# EAGLE board DuinoMite_Rev_C (EAGLE 4.16), part 1 of 2
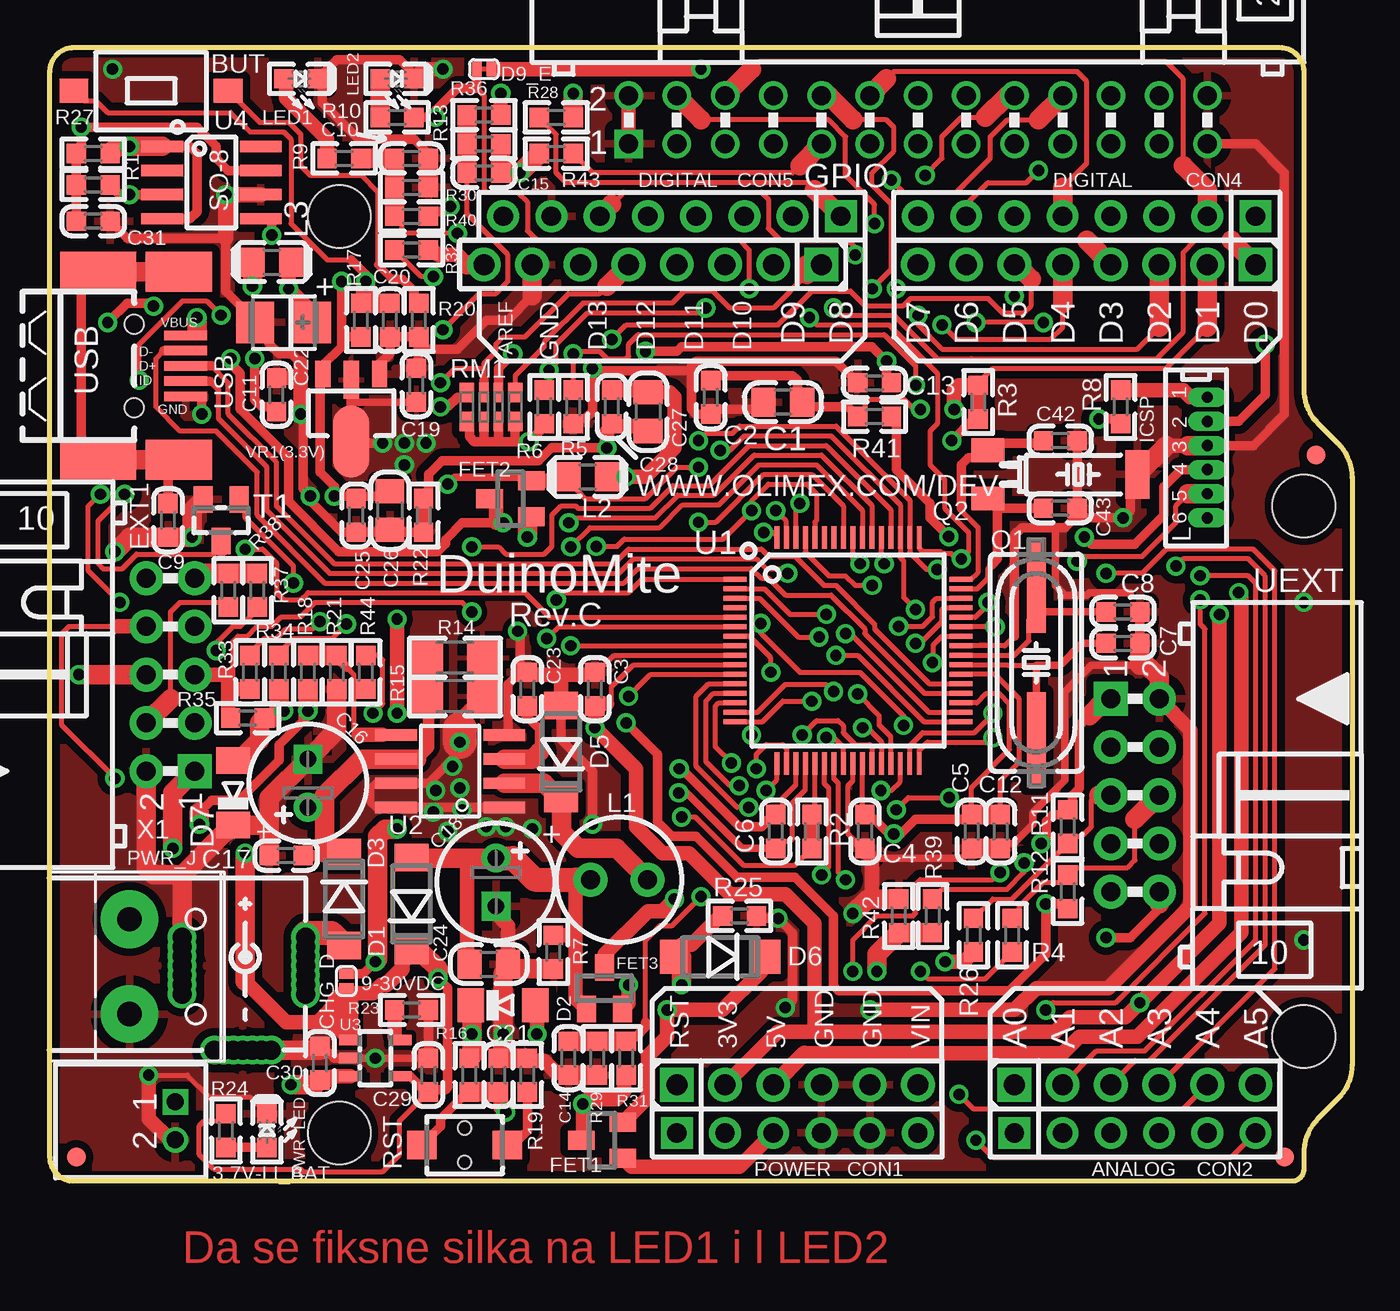
[diagram p1: board, top side]
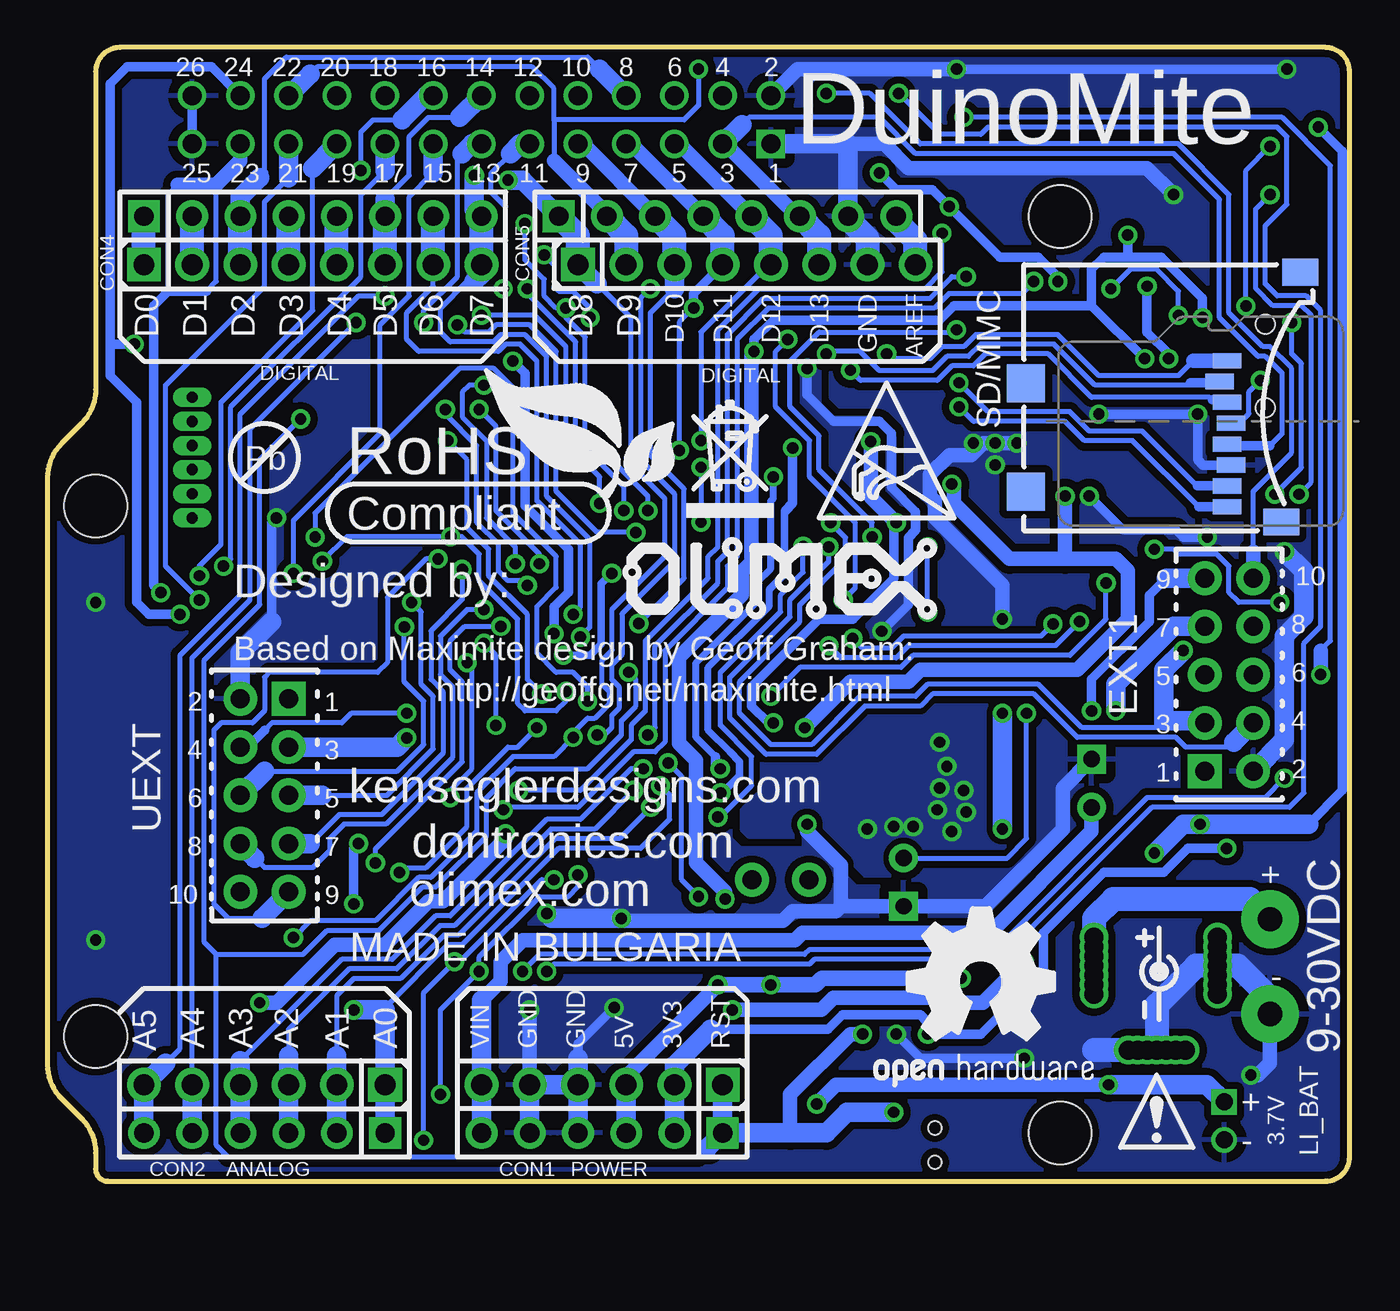
[diagram p2: board, bottom side, seen from below]

Size 68.58 x 59.69 mm. Coordinates in mm from the lower left corner, seen from the top.
Copper layers (1+16): Top 0.035mm / dielectric 1.5mm / Bottom 0.035mm
Design rules "default": minimum track width 10mil, minimum drill 0.6mm, track to track 9.5mil, track to pad 9.5mil, pad to pad 9.5mil, via to via 9.5mil, smd to smd 1mil, copper to edge 10mil, drill to drill 8mil, minimum pad ring 8mil, minimum via ring 8mil, stop-mask expansion 4mil, vias tented up to drill 25mil, thermal gap 20mil
Net classes: 1 pwr: width 0.25 mm

## Footprints (pad centres in the part's own frame; a part is rotated, then mirrored left to right if it is on the bottom)
DW02R = drill 0.9 square: 1 -1,0 | drill 0.9 round: 2 1,0
WS-TAKT_6X3.5_SMD_NOCREAM = smd 1.27 x 1.524: P$1 0,4.064; P$2 0,-4.064
C0805_5MIL_DWS = smd 1.27 x 1.524: 1 -1.016,0; 2 1.016,0
C0603_DWS = smd 1.016 x 1.016: 1 -0.889,0; 2 0.889,0
E2,5-6,3 = drill 0.864 pad 1.524 round: + -1.27,0 | drill 0.864 pad 1.524 square: - 1.27,0
CT3528 = smd 2 x 2.2: + -1.5,0; - 1.5,0
SJ_1_SMALLER = smd 0.508 x 0.762: 1 -0.381,0; 2 0.381,0
PN1X6 = drill 1.1 pad 1.778 square: 1 -6.35,0 | drill 1.1 pad 1.778 round: 2 -3.81,0; 3 -1.27,0; 4 1.27,0; 5 3.81,0; 6 6.35,0
PN1X8 = drill 1.1 pad 1.778 square: 1 -8.89,0 | drill 1.1 pad 1.778 round: 2 -6.35,0; 3 -3.81,0; 4 -1.27,0; 5 1.27,0; 6 3.81,0; 7 6.35,0; 8 8.89,0
MLL-41 = smd 1.45 x 1.8: A 2.445,0; K -2.445,0
MINI-MELF = smd 1.4 x 1.8: A 1.7,0; C -1.7,0
SJ_1_SMALLER_CLOSE = smd 0.508 x 0.762: 1 -0.381,0; 2 0.381,0
BH10R = drill 1 pad 1.778 square: 1 -5.08,-1.27 | drill 1 pad 1.778 round: 2 -5.08,1.27; 3 -2.54,-1.27; 4 -2.54,1.27; 5 0,-1.27; 6 0,1.27; 7 2.54,-1.27; 8 2.54,1.27; 9 5.08,-1.27; 10 5.08,1.27
SOT23 = smd 1 x 1.4: 1 -0.95,-1.1; 2 0.95,-1.1; 3 0,1.1
BH26R = drill 1 square: 1 -15.24,-1.27 | drill 1 round: 2 -15.24,1.27; 3 -12.7,-1.27; 4 -12.7,1.27; 5 -10.16,-1.27; 6 -10.16,1.27; 7 -7.62,-1.27; 8 -7.62,1.27; 9 -5.08,-1.27; 10 -5.08,1.27; 11 -2.54,-1.27; 12 -2.54,1.27; 13 0,-1.27; 14 0,1.27; 15 2.54,-1.27; 16 2.54,1.27; 17 5.08,-1.27; 18 5.08,1.27; 19 7.62,-1.27; 20 7.62,1.27; 21 10.16,-1.27; 22 10.16,1.27; 23 12.7,-1.27; 24 12.7,1.27; 25 15.24,-1.27; 26 15.24,1.27
SW68 = drill 1 pad 1.778 round: 1 -1.5,0; 2 1.5,0
L0805_5MIL_DWS = smd 1.27 x 1.524: 1 -1.016,0; 2 1.016,0
LED-0603 = smd 1.016 x 1.016: A 0.889,0; C -0.889,0
PWR_JACK_UNI_MILLING = drill 1 round: + 0,4.75; +1 0,5.25; +2 0,5.75; +3 0,6.25; +4 0,4.25; +5 0,3.75; +6 0,3.25; - -6.5,4.75; -1 -6.5,5.25; -2 -6.5,5.75; -3 -6.5,4.25; -4 -6.5,3.75; -5 -6.5,6.25; -6 -6.5,3.25; -- -3.3,0.3; --1 -3.8,0.3; --2 -4.3,0.3; --3 -4.8,0.3; --4 -2.8,0.3; --5 -2.3,0.3; --6 -1.8,0.3
HC49/SMD2_THIN = smd 5 x 1: 1 -4.064,0; 2 4.064,0
TC26H_3_REPAIR_SMD = smd 1.27 x 1.778: 1 -1.27,0; 2 1.27,0 | smd 2.54 x 1.27: GND 0,7.874
R0603_5MIL_DWS = smd 1.016 x 1.016: 1 -0.889,0; 2 0.889,0
0603_0R = smd 1.016 x 1.016: 1 -0.889,0; 2 0.889,0
R1206_5MIL_WS = smd 1.651 x 1.778: 1 -1.46,0; 2 1.46,0
R_MATRIX_4 = smd 1.016 x 0.762: 1.1 -0.762,1.27; 1.2 0.762,1.27; 4.1 -0.762,-1.27; 4.2 0.762,-1.27 | smd 1.016 x 0.508: 2.1 -0.762,0.381; 2.2 0.762,0.381; 3.1 -0.762,-0.381; 3.2 0.762,-0.381
IT1185AU2 = smd 1.55 x 1.5: 1 -2.25,0; 2 2.25,0 | hole 0.7: 0,-0.9; 0,0.9
TFR-MEM-CON = smd 0.8 x 1.5: 1 -3.2,10.7; 2 -2.1,10.3; 3 -1,10.7; 4 0.1,10.9; 5 1.2,10.7; 6 2.3,10.9; 7 3.4,10.7; 8 4.5,10.7 | smd 2 x 2: 9 3.7,0.1; 10 -2,0.1 | smd 1.4 x 1.9: 11 5.3,13.55; 12 -7.85,14.55
SOT-23 = smd 1 x 1.4: 1 -0.95,-1.1; 2 0.95,-1.1; 3 0,1.1
LPTQFP64 = smd 1.2 x 0.254: 1 -5.95,3.75; 2 -5.95,3.25; 3 -5.95,2.75; 4 -5.95,2.25; 5 -5.95,1.75; 6 -5.95,1.25; 7 -5.95,0.75; 8 -5.95,0.25; 9 -5.95,-0.25; 10 -5.95,-0.75; 11 -5.95,-1.25; 12 -5.95,-1.75; 13 -5.95,-2.25; 14 -5.95,-2.75; 15 -5.95,-3.25; 16 -5.95,-3.75; 33 5.95,-3.75; 34 5.95,-3.25; 35 5.95,-2.75; 36 5.95,-2.25; 37 5.95,-1.75; 38 5.95,-1.25; 39 5.95,-0.75; 40 5.95,-0.25; 41 5.95,0.25; 42 5.95,0.75; 43 5.95,1.25; 44 5.95,1.75; 45 5.95,2.25; 46 5.95,2.75; 47 5.95,3.25; 48 5.95,3.75 | smd 0.254 x 1.2: 17 -3.75,-5.95; 18 -3.25,-5.95; 19 -2.75,-5.95; 20 -2.25,-5.95; 21 -1.75,-5.95; 22 -1.25,-5.95; 23 -0.75,-5.95; 24 -0.25,-5.95; 25 0.25,-5.95; 26 0.75,-5.95; 27 1.25,-5.95; 28 1.75,-5.95; 29 2.25,-5.95; 30 2.75,-5.95; 31 3.25,-5.95; 32 3.75,-5.95; 49 3.75,5.95; 50 3.25,5.95; 51 2.75,5.95; 52 2.25,5.95; 53 1.75,5.95; 54 1.25,5.95; 55 0.75,5.95; 56 0.25,5.95; 57 -0.25,5.95; 58 -0.75,5.95; 59 -1.25,5.95; 60 -1.75,5.95; 61 -2.25,5.95; 62 -2.75,5.95; 63 -3.25,5.95; 64 -3.75,5.95
SO-8_TRM = smd 0.6 x 2.2: 1 -1.905,-2.854; 2 -0.635,-2.854; 3 0.635,-2.854; 4 1.905,-2.854; 5 1.905,2.854; 6 0.635,2.854; 7 -0.635,2.854; 8 -1.905,2.854
SOT-23-5 = smd 0.55 x 1.2: 1 -0.95,-1.3; 2 0,-1.3; 3 0.95,-1.3; 4 0.95,1.3; 5 -0.95,1.3
SO-8 = smd 0.6 x 2.2: 1 -1.905,-2.6; 2 -0.635,-2.6; 3 0.635,-2.6; 4 1.905,-2.6; 5 1.905,2.6; 6 0.635,2.6; 7 -0.635,2.6; 8 -1.905,2.6
PIC_PLATFORM_MAXMITE = drill 1.016 pad 1.676 round: 3V3 1.27,-24.13; 5V 3.81,-24.13; A1 19.05,-24.13; A2 21.59,-24.13; A3 24.13,-24.13; A4 26.67,-24.13; A5 29.21,-24.13; AREF -10.414,24.13; D1 26.67,24.13; D2 24.13,24.13; D3 21.59,24.13; D4 19.05,24.13; D5 16.51,24.13; D6 13.97,24.13; D7 11.43,24.13; D9 4.826,24.13; D10 2.286,24.13; D11 -0.254,24.13; D12 -2.794,24.13; D13 -5.334,24.13; GND 6.35,-24.13; GND@1 8.89,-24.13; GND@2 -7.874,24.13; VIN 11.43,-24.13 | drill 1.016 pad 1.676 square: A0 16.51,-24.13; D0 29.21,24.13; D8 7.366,24.13; RST -1.27,-24.13 | drill 0.6 pad 1.016 long: GND@3 26.67,12.065; PGC 26.67,9.525; PGD 26.67,10.795; PGM 26.67,8.255; RESET 26.67,14.605; VCC 26.67,13.335 | hole 3.3: 31.75,8.89; 31.75,-19.05; -19.05,24.13; -19.05,-24.13
FIDUCIAL-1X2 = smd 1 x 1: 1 0,0
USB_MINI_9PIN = smd 2.25 x 0.5: D+ 2.706,0; D- 2.706,0.8; GND 2.706,-1.6; ID 2.706,-0.8; VBUS 2.706,1.6 | smd 4 x 2.1: GND1 -1.9,4.95; GND3 -1.9,-4.95 | smd 3.5 x 2.1: GND2 2.35,4.95; GND4 2.35,-4.95 | hole 1: 0,2.2; 0,-2.2
SOT89_REP_THERMALOFF = smd 0.8 x 1.4: 1 -1.499,-1.981; 3 1.499,-1.981 | smd 0.8 x 2: 2 0,-1.681 | smd 1.93 x 3.81: P$2 0,1.57
W237-102 = drill 1.27 pad 3.048 round: 1 -2.5,-1.27; 2 2.5,-1.27

## Placement (x,y rotation side)
3.7V-LI_BAT  DW02R  [DW02R]  6.6,3.17 270 top
BUT  T1107A(6x3,8x2,5mm)  [WS-TAKT_6X3.5_SMD_NOCREAM]  5.33,57.4 90 top
C1  10uF/6.3V  [C0805_5MIL_DWS]  38.61,41.02 180 top
C2  100nF  [C0603_DWS]  34.8,41.27 270 top
C3  100nF  [C0603_DWS]  28.7,25.91 90 top
C4  10uF/6.3V  [C0603_DWS]  42.93,18.41 270 top
C5  10uF/6.3V  [C0603_DWS]  48.54,18.41 270 top
C6  100nF  [C0603_DWS]  38.23,18.41 270 top
C7  20pF  [C0603_DWS]  56.52,28.32 180 top
C8  20pF  [C0603_DWS]  56.52,29.97 180 top
C9  10nF  [C0603_DWS]  6.22,34.8 90 top
C10  10nF  [C0603_DWS]  19.05,53.85 180 top
C11  100nF  [C0603_DWS]  11.94,41.4 270 top
C12  100nF  [C0603_DWS]  50.06,18.41 90 top
C13  2.2uF  [C0603_DWS]  43.43,42.04 180 top
C14  10nF  [C0603_DWS]  27.3,6.48 90 top
C15  1uF  [C0603_DWS]  22.86,53.09 180 top
C16  CE 100uF/35V/6.3x11mm/RM2.5  [E2,5-6,3]  13.59,20.95 90 top
C17  100nF  [C0603_DWS]  12.45,17.14 180 top
C18  CE 470uF/10V/6.3x11mm/RM2.5  [E2,5-6,3]  23.5,15.75 270 top
C19  10uF/6.3V  [C0603_DWS]  19.3,41.91 90 top
C20  100nF  [C0603_DWS]  17.91,45.34 270 top
C21  4.7nF  [C0603_DWS]  23.62,5.59 90 top
C22  47uF/6.3V/TANT  [CT3528]  12.32,45.21 180 top
C23  820pF  [C0603_DWS]  25.15,25.91 90 top
C24  10uF/6.3V  [C0805_5MIL_DWS]  23.11,11.43 0 top
C25  100nF  [C0603_DWS]  16.13,35.05 270 top
C26  10uF/6.3V  [C0805_5MIL_DWS]  17.91,35.31 270 top
C27  10uF/6.3V  [C0805_5MIL_DWS]  31.5,40.51 270 top
C28  10nF  [C0603_DWS]  29.59,40.77 270 top
C29  10uF/6.3V  [C0603_DWS]  19.94,5.59 90 top
C30  2.2uF  [C0603_DWS]  14.22,6.22 90 top
C31  100nF  [C0603_DWS]  2.29,50.55 0 top
C42  27pF  [C0603_DWS]  53.21,38.99 180 top
C43  27pF  [C0603_DWS]  53.21,35.43 180 top
CHG_D  open  [SJ_1_SMALLER]  15.62,10.54 90 top
CON1  NA  [PN1X6]  39.37,5.08 0 top
CON2  NA  [PN1X6]  57.15,5.08 0 top
CON4  NA  [PN1X8]  54.61,48.26 180 top
CON5  NA  [PN1X8]  31.75,48.26 180 top
D1  1N5819S/SS14  [MLL-41]  19.05,14.61 90 top
D2  1N4148/mini-melf  [MINI-MELF]  23.88,9.27 0 top
D3  1N5819S/SS14  [MLL-41]  15.49,14.86 270 top
D5  1N5819S/SS14  [MLL-41]  26.92,22.61 90 top
D6  1N5819S/SS14  [MLL-41]  35.31,11.81 180 top
D7  1N4148/mini-melf  [MINI-MELF]  9.65,20.45 90 top
D9_E  closed  [SJ_1_SMALLER_CLOSE]  22.86,58.55 180 top
EXT1  BH10R  [BH10R]  6.35,26.67 90 top
FET1  IRLML6402  [SOT23]  29.08,2.16 90 top
FET2  IRLML6402  [SOT23]  24.26,35.94 90 top
FET3  IRLML6402  [SOT23]  29.21,10.16 0 top
GPIO  BH26R  [BH26R]  45.72,55.88 0 top
L1  CL10uH SW68  [SW68]  29.97,15.88 180 top
L2  FB0805/600R/200mA(201209-601)  [L0805_5MIL_DWS]  28.32,37.08 0 top
L3  CL470nH/0805/1.76R/250mA  [L0805_5MIL_DWS]  11.68,48.39 0 top
LED1  GREEN/0603  [LED-0603]  13.21,58.04 180 top
LED2  YELLOW/0603  [LED-0603]  18.29,58.04 180 top
PWR_J  YDJ-1136  [PWR_JACK_UNI_MILLING]  13.46,6.6 0 top
PWR_LED  RED/0603  [LED-0603]  11.43,2.67 270 top
Q1  Q8.000MHz/HC-49SM/20pF/20ppm/SMD  [HC49/SMD2_THIN]  51.94,27.3 270 top
Q2  QCT32768(2x6)/6pF  [TC26H_3_REPAIR_SMD]  49.4,37.21 270 top
R1  10k  [R0603_5MIL_DWS]  2.29,52.45 180 top
R2  0R(board mounted)  [0603_0R]  40.13,18.41 270 top
R3  0R(board mounted)  [0603_0R]  48.9,41.02 90 top
R4  330  [R0603_5MIL_DWS]  50.67,12.95 90 top
R5  1M/1%  [R0603_5MIL_DWS]  27.56,40.77 270 top
R6  10k  [R0603_5MIL_DWS]  26.04,40.77 270 top
R7  10k  [R0603_5MIL_DWS]  26.52,12.06 270 top
R8  33R  [R0603_5MIL_DWS]  56.39,40.77 270 top
R9  1k  [R0603_5MIL_DWS]  15.49,53.85 0 top
R10  1k  [R0603_5MIL_DWS]  18.29,56.01 0 top
R11  4.7k  [R0603_5MIL_DWS]  53.59,18.67 90 top
R12  4.7k  [R0603_5MIL_DWS]  53.59,15.24 270 top
R13  100k  [R0603_5MIL_DWS]  22.86,54.61 180 top
R14  0.47R  [R1206_5MIL_WS]  21.34,27.56 0 top
R15  0.47R  [R1206_5MIL_WS]  21.34,25.53 0 top
R16  4.7k  [R0603_5MIL_DWS]  22.1,5.59 270 top
R17  4.7k  [R0603_5MIL_DWS]  16.38,45.34 90 top
R18  NA(3k/1%)  [R0603_5MIL_DWS]  13.59,26.8 90 top
R19  330R  [R0603_5MIL_DWS]  25.15,5.59 270 top
R20  330R  [R0603_5MIL_DWS]  19.43,45.34 90 top
R21  1k/1%  [R0603_5MIL_DWS]  15.11,26.8 270 top
R22  0R(board mounted)  [0603_0R]  19.68,35.05 90 top
R23  15k  [R0603_5MIL_DWS]  19.05,9.02 180 top
R24  1k  [R0603_5MIL_DWS]  9.27,2.67 270 top
R25  4.7k  [R0603_5MIL_DWS]  36.32,13.97 0 top
R26  330  [R0603_5MIL_DWS]  48.64,12.95 90 top
R27  10k  [R0603_5MIL_DWS]  2.29,54.1 180 top
R28  10k  [R0603_5MIL_DWS]  26.67,56.01 180 top
R29  470k/1%  [R0603_5MIL_DWS]  28.83,6.48 90 top
R30  100k/1%  [R0603_5MIL_DWS]  19.05,52.32 180 top
R31  1M/1%  [R0603_5MIL_DWS]  30.35,6.48 270 top
R32  120R  [R0603_5MIL_DWS]  19.05,49.02 180 top
R33  1k  [R0603_5MIL_DWS]  10.54,26.8 270 top
R34  120R  [R0603_5MIL_DWS]  12.06,26.8 270 top
R35  680R  [R0603_5MIL_DWS]  10.41,24.38 0 top
R36  10k  [R0603_5MIL_DWS]  22.86,56.13 0 top
R37  4.7k  [R0603_5MIL_DWS]  10.92,31.11 90 top
R38  4.7k  [R0603_5MIL_DWS]  9.4,31.11 90 top
R39  5.6k  [R0603_5MIL_DWS]  46.48,13.97 270 top
R40  1M/1%  [R0603_5MIL_DWS]  19.05,50.8 0 top
R41  4.7k  [R0603_5MIL_DWS]  43.43,40.26 0 top
R42  1k  [R0603_5MIL_DWS]  44.7,13.97 270 top
R43  10k  [R0603_5MIL_DWS]  26.67,54.1 180 top
R44  3.3k/1%  [R0603_5MIL_DWS]  16.64,26.8 270 top
RM1  100k  [R_MATRIX_4]  23.24,40.77 90 top
RST  IT1185AU2  [IT1185AU2]  21.84,1.91 0 top
SD/MMC  MICRO  [TFR-MEM-CON]  17.14,40.01 270 bottom
T1  DTC114YKA  [SOT-23]  9.02,34.8 180 top
U1  PIC32MX795F512H-80I/PT  [LPTQFP64]  42.04,27.94 0 top
U2  MC33063ADR(SO8)  [SO-8_TRM]  21.08,21.59 90 top
U3  MCP73812T-420I/OT  [SOT-23-5]  17.14,6.48 270 top
U4  LM3526M-L(SO8)  [SO-8]  8.51,52.58 270 top
U$1  2xPN1x8+2xPN1x6+WU06S  [PIC_PLATFORM_MAXMITE]  34.29,26.67 0 top
U$2  FIDUCIAL1X2  [FIDUCIAL-1X2]  1.4,1.27 90 top
U$3  FIDUCIAL1X2  [FIDUCIAL-1X2]  65.02,1.27 90 top
U$4  FIDUCIAL1X2  [FIDUCIAL-1X2]  66.67,38.23 90 top
U$5  [PB_SMALL]  57.15,38.1 0 bottom
U$6  [RECYCLE_BIN1/8]  34.92,34.92 0 bottom
U$7  [ESD_SYMBOL]  27.94,34.92 0 bottom
U$8  [ATTENTION]  12.06,1.78 0 bottom
U$10  [ROHS]  52.83,34.29 0 bottom
U$11  [OLIMEX1_V]  20.57,29.46 0 bottom
U$12  [LOGO-OPENHARDWARE_8X8]  19.43,10.41 0 bottom
UEXT  BH10R  [BH10R]  57.15,20.32 270 top
USB  USB-OTG  [USB_MINI_9PIN]  4.45,42.93 0 top
VR1(3.3V)  MCP1700T-3302E/MB  [SOT89_REP_THERMALOFF]  15.88,40.51 180 top
X1  NA  [W237-102]  5.46,11.3 270 top